# Altium schematic sheet analog_inputs_not_isolated.SchDoc: foxBMS BMS-Extension
size A3; DocumentNumber: 11; SheetNumber: 11; SheetTotal: 14; Author: Fraunhofer IISB foxBMS Team; REL-DATE: 2017-05-16; VERSION: 1.0.2; GateName_1: G$1; SymbolName_1: FRAME_B_L; LibraryName: foxBMS_BMS-Master_V1.00_A; DeviceSetName: FRAME_B_L; GateName_2: G$2; SymbolName_2: DOCFIELD; SheetDescription: Analog Inputs (not isolated)
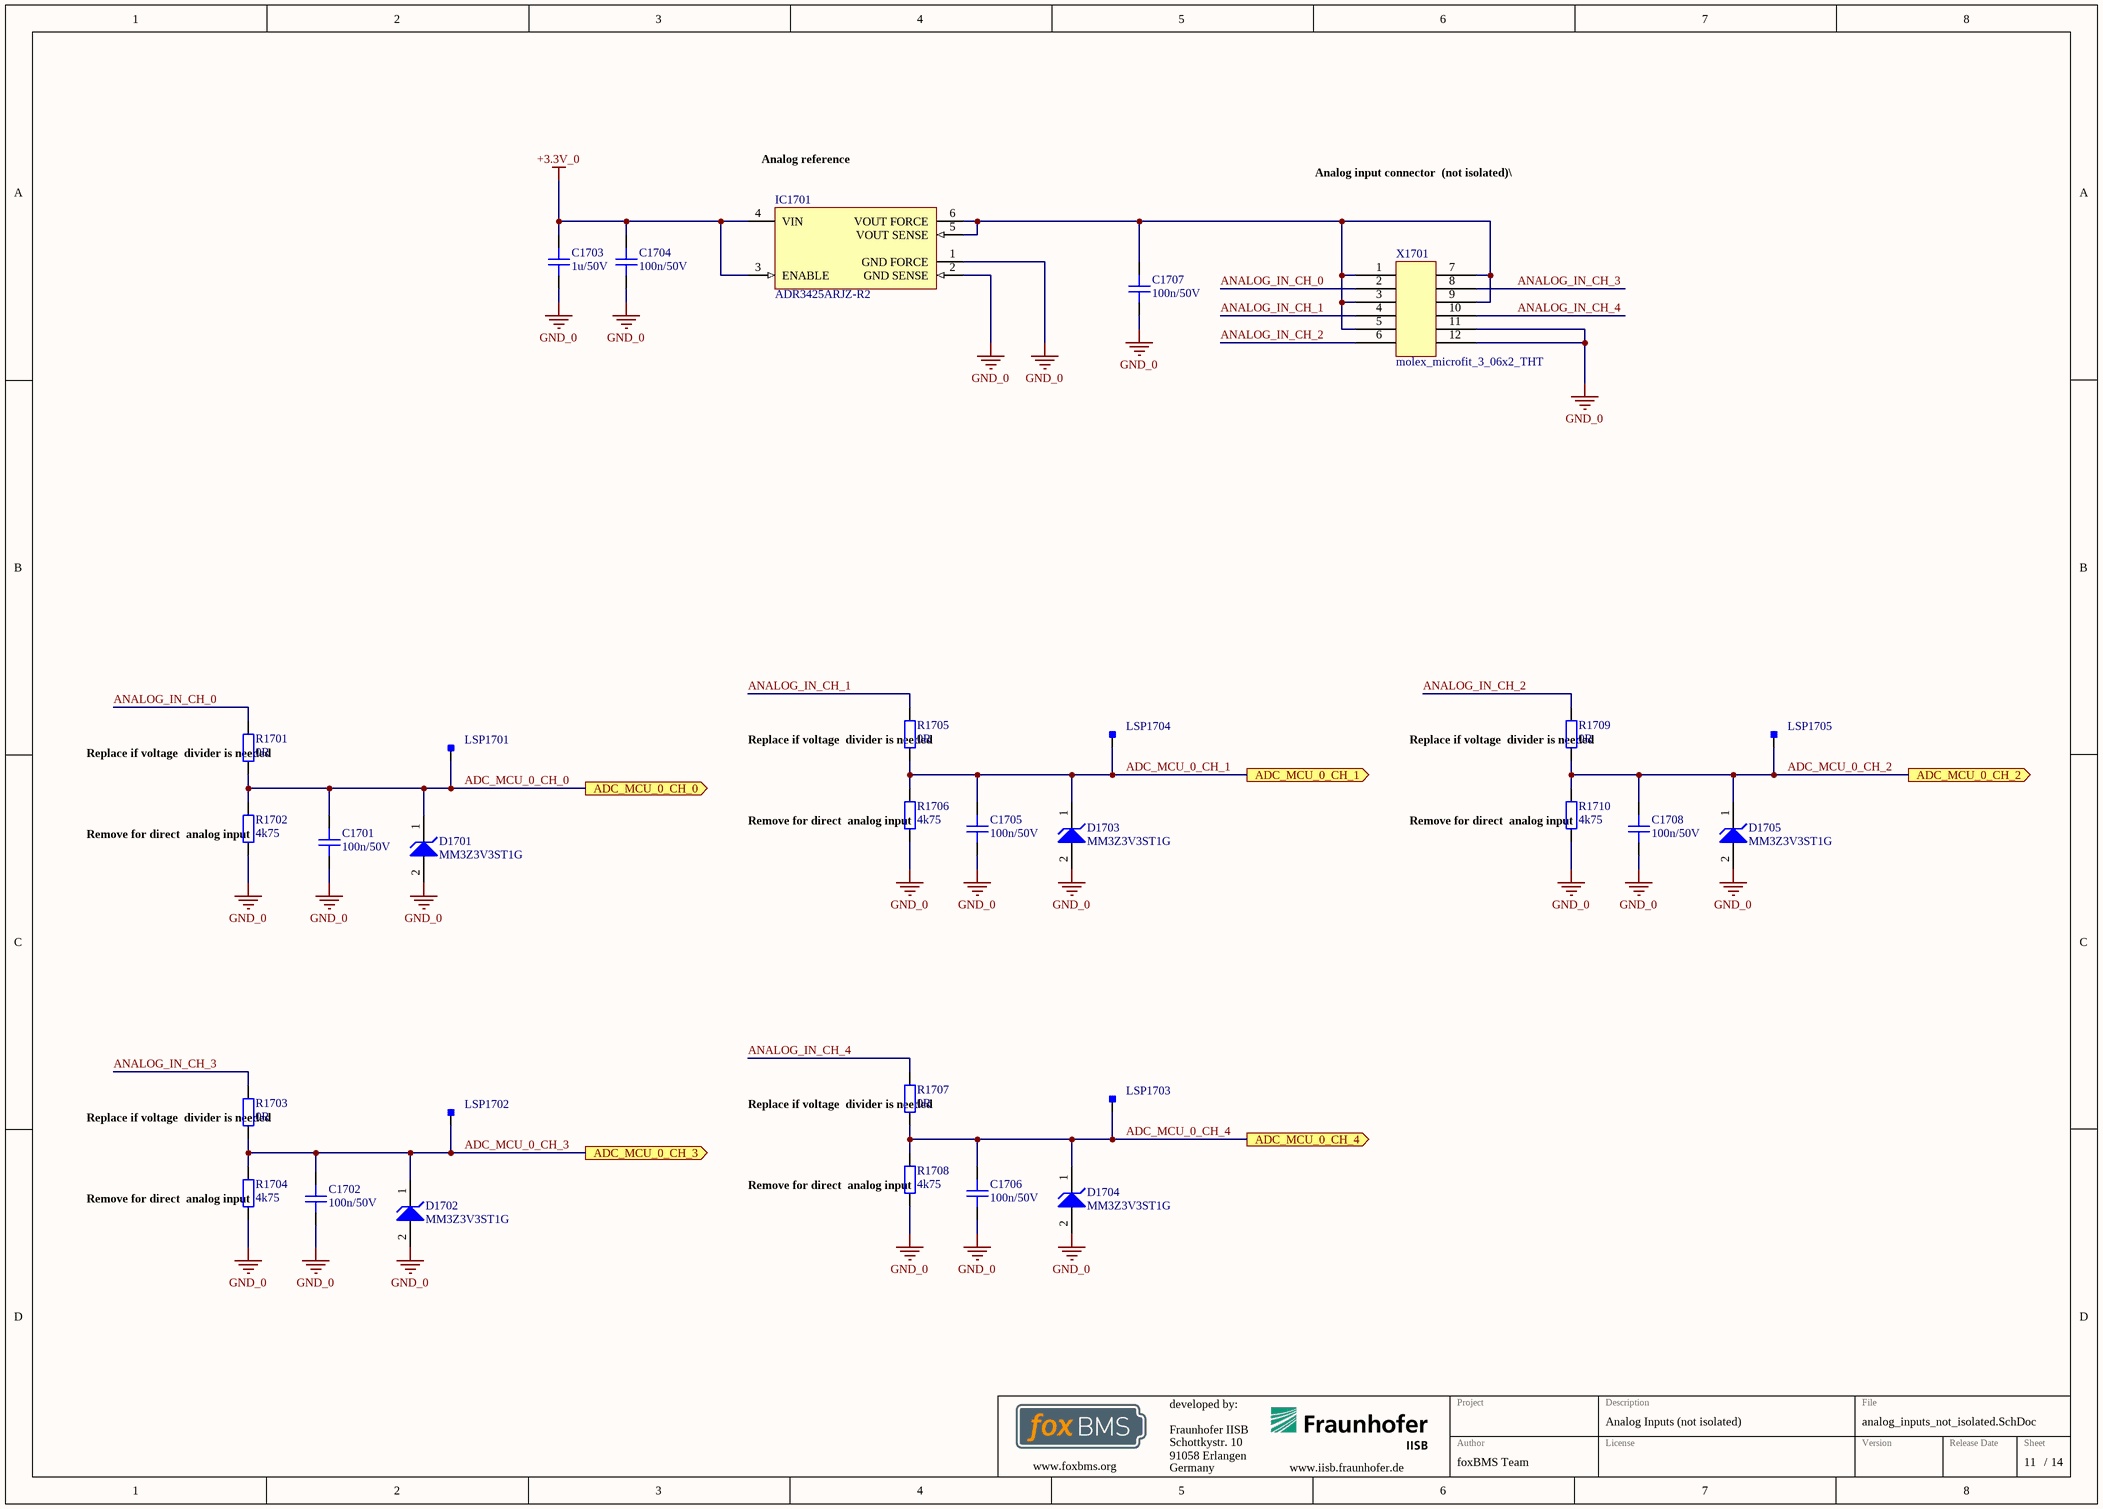
[diagram p0: analog_inputs_not_isolated.SchDoc]

## Parts
C1701  100n/50V  [CAPC1608X08N]
C1702  100n/50V  [CAPC1608X08N]
C1703  1u/50V  [CAPC1608X08N]
C1704  100n/50V  [CAPC1608X08N]
C1705  100n/50V  [CAPC1608X08N]
C1706  100n/50V  [CAPC1608X08N]
C1707  100n/50V  [CAPC1608X08N]
C1708  100n/50V  [CAPC1608X08N]
D1701  MM3Z3V3ST1G  [ONSC-SOD-323-2-477-02_V]
D1702  MM3Z3V3ST1G  [ONSC-SOD-323-2-477-02_V]
D1703  MM3Z3V3ST1G  [ONSC-SOD-323-2-477-02_V]
D1704  MM3Z3V3ST1G  [ONSC-SOD-323-2-477-02_V]
D1705  MM3Z3V3ST1G  [ONSC-SOD-323-2-477-02_V]
IC1701  ADR3425ARJZ-R2  [ADI-RJ-6_N]
LSP1701  Testpoint_Square  [Testpoint_S1]  (value not drawn)  (no BOM)
LSP1702  Testpoint_Square  [Testpoint_S1]  (value not drawn)  (no BOM)
LSP1703  Testpoint_Square  [Testpoint_S1]  (value not drawn)  (no BOM)
LSP1704  Testpoint_Square  [Testpoint_S1]  (value not drawn)  (no BOM)
LSP1705  Testpoint_Square  [Testpoint_S1]  (value not drawn)  (no BOM)
R1701  0R  [RESC1608X05N]
R1702  4k75  [RESC1608X05N]
R1703  0R  [RESC1608X05N]
R1704  4k75  [RESC1608X05N]
R1705  0R  [RESC1608X05N]
R1706  4k75  [RESC1608X05N]
R1707  0R  [RESC1608X05N]
R1708  4k75  [RESC1608X05N]
R1709  0R  [RESC1608X05N]
R1710  4k75  [RESC1608X05N]
X1701  molex_microfit_3_06x2_THT  [43045-1221]

## Ports
ADC_MCU_0_CH_0 (out), ADC_MCU_0_CH_1 (out), ADC_MCU_0_CH_2 (out), ADC_MCU_0_CH_3 (out), ADC_MCU_0_CH_4 (out)

## Nets
+3.3V_0: C1703.1 C1704.1 IC1701.3(ENABLE) IC1701.4(VIN)
GND_0: C1701.2 C1702.2 C1703.2 C1704.2 C1705.2 C1706.2 C1707.2 C1708.2 D1701.2(A) D1702.2(A) D1703.2(A) D1704.2(A) D1705.2(A) IC1701.1(GND_FORCE) IC1701.2(GND_SENSE) R1702.2 R1704.2 R1706.2 R1708.2 R1710.2 X1701.11 X1701.12
ADC_MCU_0_CH_0: C1701.1 D1701.1(K) LSP1701.1 R1701.2 R1702.1 ; port ADC_MCU_0_CH_0
ADC_MCU_0_CH_1: C1705.1 D1703.1(K) LSP1704.1 R1705.2 R1706.1 ; port ADC_MCU_0_CH_1
ADC_MCU_0_CH_2: C1708.1 D1705.1(K) LSP1705.1 R1709.2 R1710.1 ; port ADC_MCU_0_CH_2
ADC_MCU_0_CH_3: C1702.1 D1702.1(K) LSP1702.1 R1703.2 R1704.1 ; port ADC_MCU_0_CH_3
ADC_MCU_0_CH_4: C1706.1 D1704.1(K) LSP1703.1 R1707.2 R1708.1 ; port ADC_MCU_0_CH_4
ANALOG_IN_CH_0: R1701.1 X1701.2
ANALOG_IN_CH_1: R1705.1 X1701.4
ANALOG_IN_CH_2: R1709.1 X1701.6
ANALOG_IN_CH_3: R1703.1 X1701.8
ANALOG_IN_CH_4: R1707.1 X1701.10
NetC1707_1: C1707.1 IC1701.5(VOUT_SENSE) IC1701.6(VOUT_FORCE) X1701.1 X1701.3 X1701.5 X1701.7 X1701.9

## Notes on the sheet
- Analog reference
- Analog input connector
  (not isolated)\
- (near R1701) Replace if voltage
  divider is needed
- (near R1705) Replace if voltage
  divider is needed
- (near R1709) Replace if voltage
  divider is needed
- (near R1702) Remove for direct
  analog input
- (near R1706) Remove for direct
  analog input
- (near R1710) Remove for direct
  analog input
- (near R1703) Replace if voltage
  divider is needed
- (near R1707) Replace if voltage
  divider is needed
- (near R1708) Remove for direct
  analog input
- (near R1704) Remove for direct
  analog input
- Fraunhofer IISB
- Schottkystr. 10
- developed by:
- 91058 Erlangen
- Germany
- Author
- Project
- License
- Description
- File
- Version
- Release Date
- Sheet
- www.foxbms.org
- www.iisb.fraunhofer.de
- foxBMS Team
- /

## Library data of the parts
C1701 C1702 C1704-C1708 = gen_C_ceramic_100n_50V_X7R_0603: MLCC; Capacitance: 100n; Rated Voltage: 50V; Dielectric: X7R; Case EIA: 0603; Case Metric: 1608; PnP Package: C_0603_10; PnP Value: 100n/50V/X7R; PnP equipped: x; Part Number: gen_C_ceramic_100n_50V_X7R_0603; Supplier 1: Farnell; Supplier Part Number 1: 2525267
C1703 = gen_C_ceramic_1u_50V_X7R_0603: MLCC; Capacitance: 1u; Rated Voltage: 50V; Dielectric: X7R; Tolerance: ± 10%; Case EIA: 0603; Case Metric: 1608; Part Number: gen_C_ceramic_1u_50V_X7R_0603; Operating Temperature: -55°C - +125°C; Supplier 1: Farnell; Supplier Part Number 1: 2779055
D1701-D1705 = CMP-1060-00652-1: Zener Voltage Regulator, 300 mW, Tight Tolerance Portfolio, 2-Pin SOD-323, Pb-Free, Tape and Reel; Manufacturer: On Semiconductor; P Max (W): 0.3; PartNumber: MM3Z3V3ST1G; DatasheetVersion: Rev. 21; PackageVersion: Rev. H, 03/2007; Packing: Tape and Reel; PackageReference: SOD-323-2-477-02; RoHS: Pb-Free; Mounting Technology: Surface Mount; ComponentLink2URL: http://www.onsemi.cn/pub_link/Collateral/MM3Z2V4ST1-D.PDF; ComponentLink1URL: http://www.onsemi.com/; ComponentLink2Description: Datasheet; ComponentLink1Description: Manufacturer URL; ComponentLink3Description: Package Specification; PackageDescription: 2-Pin SOD, Body 1.7 x 1.25 mm; ComponentLink3URL: http://www.onsemi.com/pub_link/Collateral/477-02.PDF.1
IC1701 = CMP-0784-00366-1: Micropower, High Accuracy Voltage Reference, 2.5 V Output, 2.7 to 5.5 V Supply, Industrial, 6-pin SOT23 (RJ-6), Reel; Manufacturer: Analog Devices; Vout: 2.5V; Ref Out TC (ppm/C): 2.5; Min V Supply (V): 2.7; Max V Supply (V): 5.5; ComponentLink3URL: http://www.analog.com/static/imported-files/packages/PKG_PDF/SOT-23(RJ)/RJ_6.pdf; Mounting Technology: Surface Mount; Packing: Reel; ComponentLink3Description: Package Specification; Code_JEDEC: MO-178-AB; PackageReference: RJ-6; Operating Temp Range: -40 to 125 degC; PartNumber: ADR3425ARJZ-R2; ComponentLink2Description: Datasheet; PackageDescription: 6-Pin Small Outline Transistor Package, Body 2.9 x 1.6 mm, Pitch 0.95 mm; ComponentLink1URL: http://www.analog.com/en/index.html; ComponentLink2URL: http://www.analog.com/static/imported-files/data_sheets/ADR3412_ADR3420_ADR3425_ADR3430_ADR3433_ADR3440_ADR3450.pdf; ComponentLink1Description: Manufacturer URL; PackageVersion: 121608-A, 12/2008; ComponentLink4URL: Product URL:http://www.analog.com/en/special-linear-functions/voltage-references/adr3425/products/product.html; ComponentLink4Description: URL Link1; DatasheetVersion: Rev. B
LSP1701-LSP1705 = Testpoint_Square: Testpoint, square; Part Number: Testpoint_Square
R1701 R1703 R1705 R1707 R1709 = gen_R_0R_0603: SMD Resistor 0R 0603; Power: 0.1W; Case EIA: 0603; Case Metric: 1608; PnP Package: R_0603; Maximum Working Voltage: 75V; Part Number: gen_R_0R_0603; Operating Temperature: -55°C - +155°C; Resistance: 0R; Series: Jumper; PnP Value: 0R; Supplier 1: Farnell; Supplier Part Number 1: 2073345
R1702 R1704 R1706 R1708 R1710 = gen_R_4k75_0603: SMD Resistor 4k75 0603; Tolerance: 1%; Power: 0.1W; Case EIA: 0603; Case Metric: 1608; Maximum Working Voltage: 75V; PnP Package: R_0603; Part Number: gen_R_4k75_0603; Operating Temperature: -55°C - +155°C; Resistance: 4k75; Series: E96; PnP Value: 4k75; Supplier 1: Farnell; Supplier Part Number 1: 2073517
X1701 = molex_microfit_3_06x2_THT: Micro-Fit 3.0 Right Angle Header, 3.00mm Pitch, Dual Row, 12 Circuits, with Snap-in Plastic Peg PCB Lock, Tin, Glow Wire Capable, Black, 43045-1200; Manufacturer: Molex; Circuits: 12; Rated Current: 8.5A; Rated Voltage: 600V; System: Connector; Part Number: molex_microfit_3_06x2_THT; Operating Temperature: -40°C - +105°C; Part Name: MicroFit; Supplier 1: Farnell; Supplier Part Number 1: 9732977